# Altium schematic sheet PART-04-各主持人控制电路R200-249.SchDoc
size A4
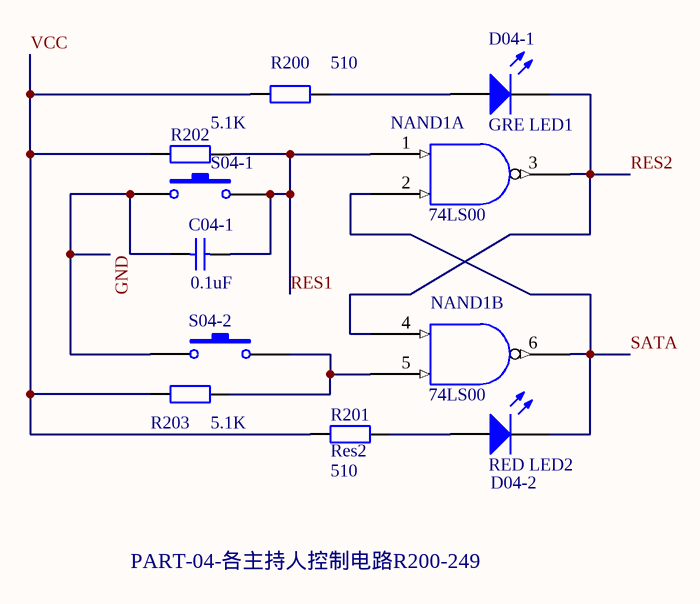
[diagram p0: PART-04-各主持人控制电路R200-249.SchDoc]

## Parts
C04-1  value 0.1uF  [RAD-0.3]  (hidden comment: Cap)
D04-1  GRE LED1  [LED-1]
D04-2  RED LED2  [LED-1]
NAND1  74LS00  [DIP-14]  (parts A,B of 4)
R200  value 510  [AXIAL-0.4]  (hidden comment: Res2)
R201  Res2  value 510  [AXIAL-0.4]
R202  value 5.1K  [AXIAL-0.4]  (hidden comment: Res2)
R203  value 5.1K  [AXIAL-0.4]  (hidden comment: Res2)
S04-1  SW-PB  [SPST-2]  (value not drawn)
S04-2  SW-PB  [SPST-2]  (value not drawn)

## Nets
GND: C04-1.1 NAND1.7(GND) S04-1.1 S04-2.1
VCC: NAND1.14(VCC) R200.1 R201.1 R202.1 R203.1
RES1: C04-1.2 NAND1.1 R202.2 S04-1.2
RES2: D04-1.2(K) NAND1.3 NAND1.4
SATA: D04-2.2(K) NAND1.2 NAND1.6
NetD04-1_1: D04-1.1(A) R200.2
NetD04-2_1: D04-2.1(A) R201.2
NetNAND1_5: NAND1.5 R203.2 S04-2.2

## Notes on the sheet
- PART-04-各主持人控制电路R200-249

## Library data of the parts
C04-1 = Cap: Capacitor; Published: 8-Jun-2000; LatestRevisionDate: 17-Jul-2002; LatestRevisionNote: Re-released for DXP Platform.; PackageReference: RAD-0.3; Publisher: Altium Limited
D04-1 D04-2 = LED1: Typical RED GaAs LED; Published: 8-Jun-2000; LatestRevisionDate: 08-Jul-2005; LatestRevisionNote: Mech Layer 1 removed.; PackageReference: LED-1; Publisher: Altium Limited
R200-R203 = Res2: Resistor; Published: 8-Jun-2000; LatestRevisionDate: 17-Jul-2002; LatestRevisionNote: Re-released for DXP Platform.; PackageReference: AXIAL-0.4; Publisher: Altium Limited
S04-1 S04-2 = SW-PB: Switch; Published: 24-Mar-1999; LatestRevisionDate: 17-Jul-2002; LatestRevisionNote: Re-released for DXP Platform.; PackageReference: SPST-2; Publisher: Altium Limited